# EAGLE design filtre 40kHz (EAGLE 6.3)
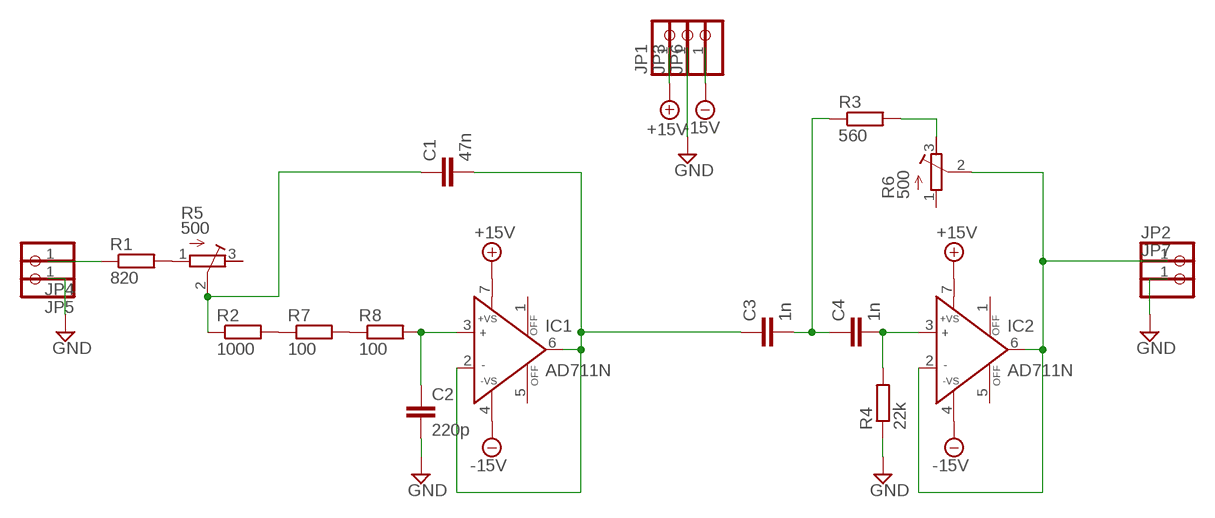
[diagram p0: schematic, sheet 1]

## Parts
C1  47n  C-EU050-024X044  [C050-024X044]
C2  220p  C-EU050-024X044  [C050-024X044]
C3  1n  C-EU075-032X103  [C075-032X103]
C4  1n  C-EU050-024X044  [C050-024X044]
IC1  AD711N  [DIL08]
IC2  AD711N  [DIL08]
JP1  PINHD-1X1  [1X01]
JP2  PINHD-1X1  [1X01]
JP3  PINHD-1X1  [1X01]
JP4  PINHD-1X1  [1X01]
JP5  PINHD-1X1  [1X01]
JP6  PINHD-1X1  [1X01]
JP7  PINHD-1X1  [1X01]
R1  820  R-EU_0204/7  [0204/7]
R2  1000  R-EU_0204/7  [0204/7]
R3  560  R-EU_0204/7  [0204/7]
R4  22k  R-EU_0204/7  [0204/7]
R5  500  R-TRIMM3339P  [RTRIM3339P]
R6  500  R-TRIMM3339P  [RTRIM3339P]
R7  100  R-EU_0207/2V  [0207/2V]
R8  100  R-EU_0207/2V  [0207/2V]

## Nets
+15V: IC1.7(+VS) IC2.7(+VS) JP1.1
-15V: IC1.4(-VS) IC2.4(-VS) JP6.1
GND: C2.2 JP3.1 JP5.1 JP7.1 R4.1
N$1: C2.1 IC1.3(IN+) R8.2
N$2: R2.2 R7.1
N$3: R7.2 R8.1
N$4: R1.2 R5.1(E)
N$5: C1.1 R2.1 R5.2(S)
N$6: C1.2 C3.1 IC1.2(IN-) IC1.6(OUT)
N$7: C3.2 C4.1 R3.1
N$8: C4.2 IC2.3(IN+) R4.2
N$9: IC2.2(IN-) IC2.6(OUT) JP2.1 R6.2(S)
N$10: R3.2 R6.3(A)
N$11: JP4.1 R1.1
Unconnected: IC1.1(OFF) IC1.5(OFF) IC2.1(OFF) IC2.5(OFF) R5.3(A) R6.1(E)

## Library data of the parts
C1-C4 = resistor:C-EU: CAPACITOR, European symbol
IC1 IC2 = analog-devices:AD711: Precision, Low Cost, High Speed, BiFET Op Amp Source: http://www.analog.com/static/imported-files/data_sheets/AD711.pdf; MPN: AD711BQ; OC_FARNELL: 9604839; OC_NEWARK: 66F5826
JP1-JP7 = pinhead:PINHD-1X1: PIN HEADER
R1-R4 R7 R8 = resistor:R-EU_: RESISTOR, European symbol
R5 R6 = resistor:R-TRIMM: Trimm resistor

## Board
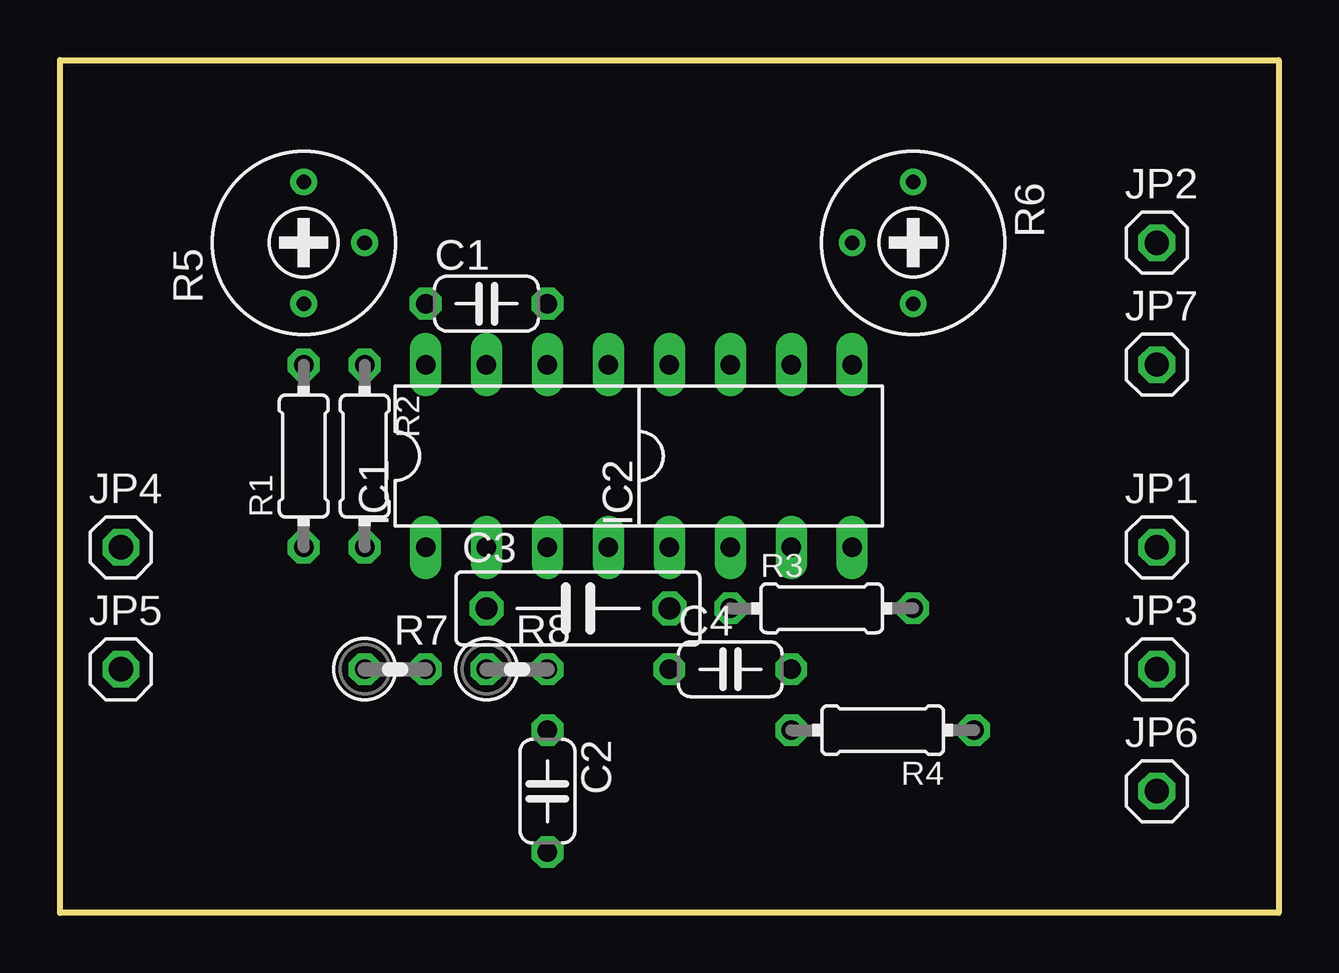
[diagram p1: board, top side]
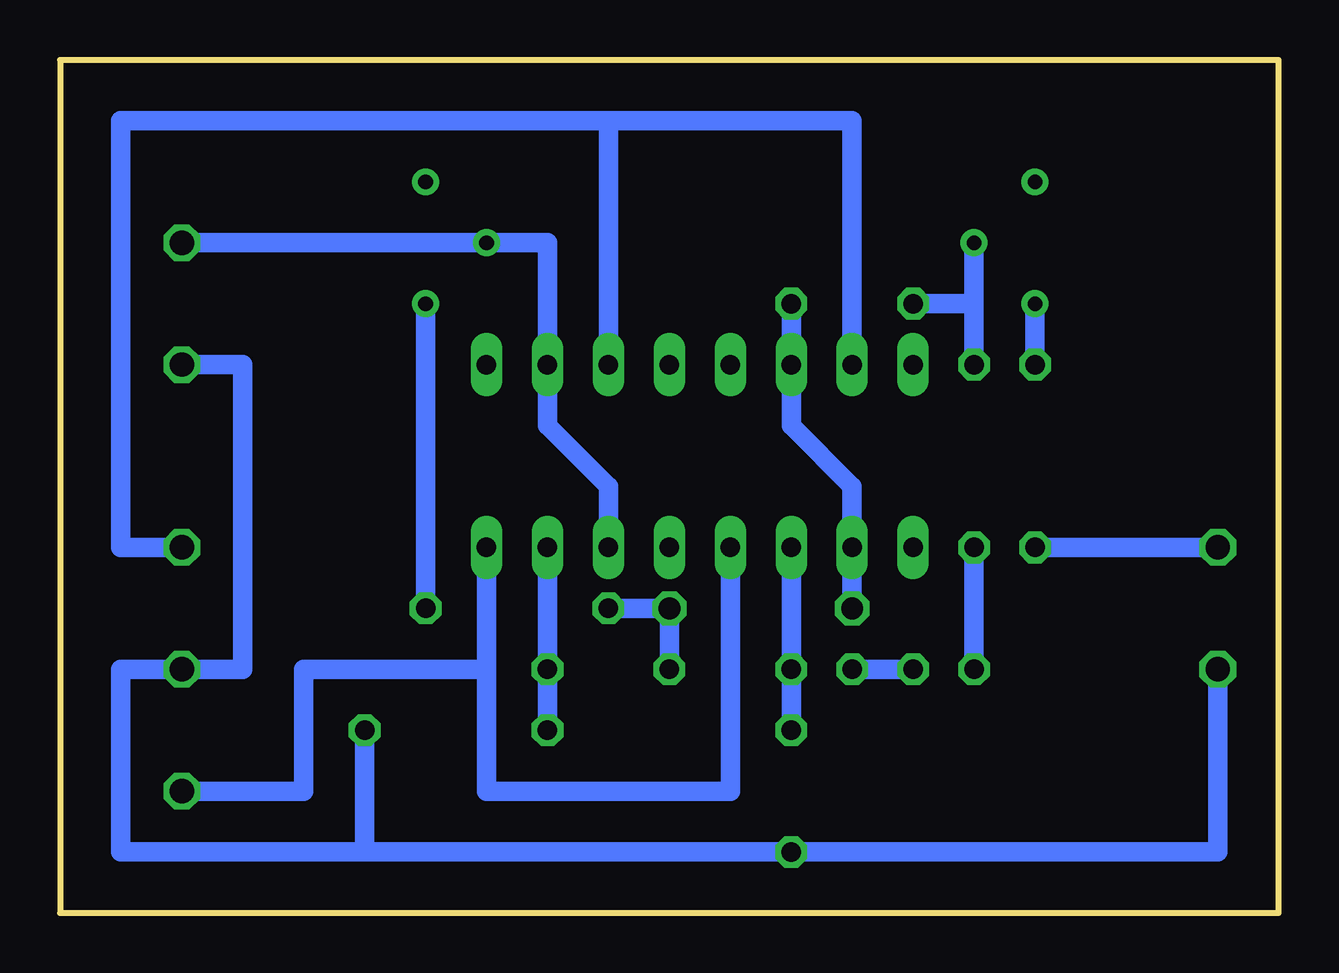
[diagram p2: board, bottom side, seen from below]

Size 50.8 x 35.56 mm. Coordinates in mm from the lower left corner, seen from the top.
Outline: 0,0 0,35.56 50.8,35.56 50.8,0 0,0
Copper layers (1*16): Top 0.035mm / dielectric 1.5mm / Bottom 0.035mm
Design rules "default": minimum track width 10mil, minimum drill 24mil, track to track 8mil, track to pad 8mil, pad to pad 8mil, via to via 8mil, smd to smd 8mil, copper to edge 40mil, drill to drill 8mil, minimum pad ring 10mil, minimum via ring 8mil, stop-mask expansion 4mil, vias tented up to drill 0mil, thermal gap 10mil

### Footprints (pad centres in the part's own frame; a part is rotated, then mirrored left to right if it is on the bottom)
C050-024X044 = drill 0.813 octagon: 1 -2.54,0; 2 2.54,0
C075-032X103 = drill 0.914 octagon: 1 -3.81,0; 2 3.81,0
DIL08 = drill 0.813 long: 1 -3.81,-3.81; 2 -1.27,-3.81; 3 1.27,-3.81; 4 3.81,-3.81; 5 3.81,3.81; 6 1.27,3.81; 7 -1.27,3.81; 8 -3.81,3.81
1X01 = drill 1.016 octagon: 1 0,0
0204/7 = drill 0.813 octagon: 1 -3.81,0; 2 3.81,0
RTRIM3339P = drill 0.61: 1 -2.54,0; 2 0,-2.54; 3 2.54,0
0207/2V = drill 0.813 octagon: 1 -1.27,0; 2 1.27,0

### Placement (x,y rotation side)
C1  17.78,25.4 0 top
C2  20.32,5.08 270 top
C3  21.59,12.7 0 top
C4  27.94,10.16 0 top
IC1  19.05,19.05 0 top
IC2  29.21,19.05 0 top
JP1  45.72,15.24 0 top
JP2  45.72,27.94 0 top
JP3  45.72,10.16 0 top
JP4  2.54,15.24 0 top
JP5  2.54,10.16 0 top
JP6  45.72,5.08 0 top
JP7  45.72,22.86 0 top
R1  10.16,19.05 90 top
R2  12.7,19.05 270 top
R3  31.75,12.7 0 top
R4  34.29,7.62 180 top
R5  10.16,27.94 90 top
R6  35.56,27.94 270 top
R7  13.97,10.16 0 top
R8  19.05,10.16 0 top

### Tracks (layer width: path | path; a pad name or v marks a point on that pad's centre or on a via)
+15V
  Bottom 0.813: JP1.1 48.26,15.24 48.26,33.02 27.94,33.02 | 27.94,33.02 IC2.7 | IC1.7 17.78,33.02 27.94,33.02
-15V
  Bottom 0.813: IC2.4 33.02,10.16 | 33.02,10.16 40.64,10.16 40.64,5.08 JP6.1 | IC1.4 22.86,5.08 33.02,5.08 33.02,10.16
GND
  Bottom 0.813: JP5.1 2.54,2.54 C2.2 38.1,2.54 | 38.1,2.54 48.26,2.54 48.26,10.16 JP3.1 43.18,10.16 43.18,22.86 JP7.1 | R4.1 38.1,2.54
N$1
  Bottom 0.813: IC1.3 R8.2 C2.1
N$2
  Bottom 0.813: R2.2 R7.1
N$3
  Bottom 0.813: R7.2 R8.1
N$4
  Bottom 0.813: R1.2 R5.1
N$5
  Bottom 0.813: R2.1 12.7,25.4 | 12.7,25.4 R5.2 | C1.1 12.7,25.4
N$6
  Bottom 0.813: C1.2 IC1.6 20.32,20.32 17.78,17.78 IC1.2 C3.1
N$7
  Bottom 0.813: R3.1 C3.2 C4.1
N$8
  Bottom 0.813: IC2.3 C4.2 R4.2
N$9
  Bottom 0.813: IC2.2 27.94,17.78 30.48,20.32 IC2.6 30.48,27.94 R6.2 JP2.1
N$10
  Bottom 0.813: R3.2 R6.3
N$11
  Bottom 0.813: JP4.1 R1.1